# Altium schematic sheet 4 - Position2Go_Baseband.SchDoc
size A3; Release: RC00; PageSetup: Record=PageOptions|CenterHorizontal=True|CenterVertical=True|PrintScale=1.01|XCorrection=1.00|YCorrection=1.00|PrintKind=0|BorderSize=5000000|LeftOffset=0|BottomOffset=0|Orientation=2|PaperLength=1000|PaperWidth=1000|Scale=100|PaperSource=7|PrintQuality=-4|MediaType=1|DitherType=10|PaperKind=A3|PrintScaleMode=1; Doc_ConfidentialStatus: <Doc_ConfidentialStatus>; Doc_Preliminary: <Doc_Preliminary>
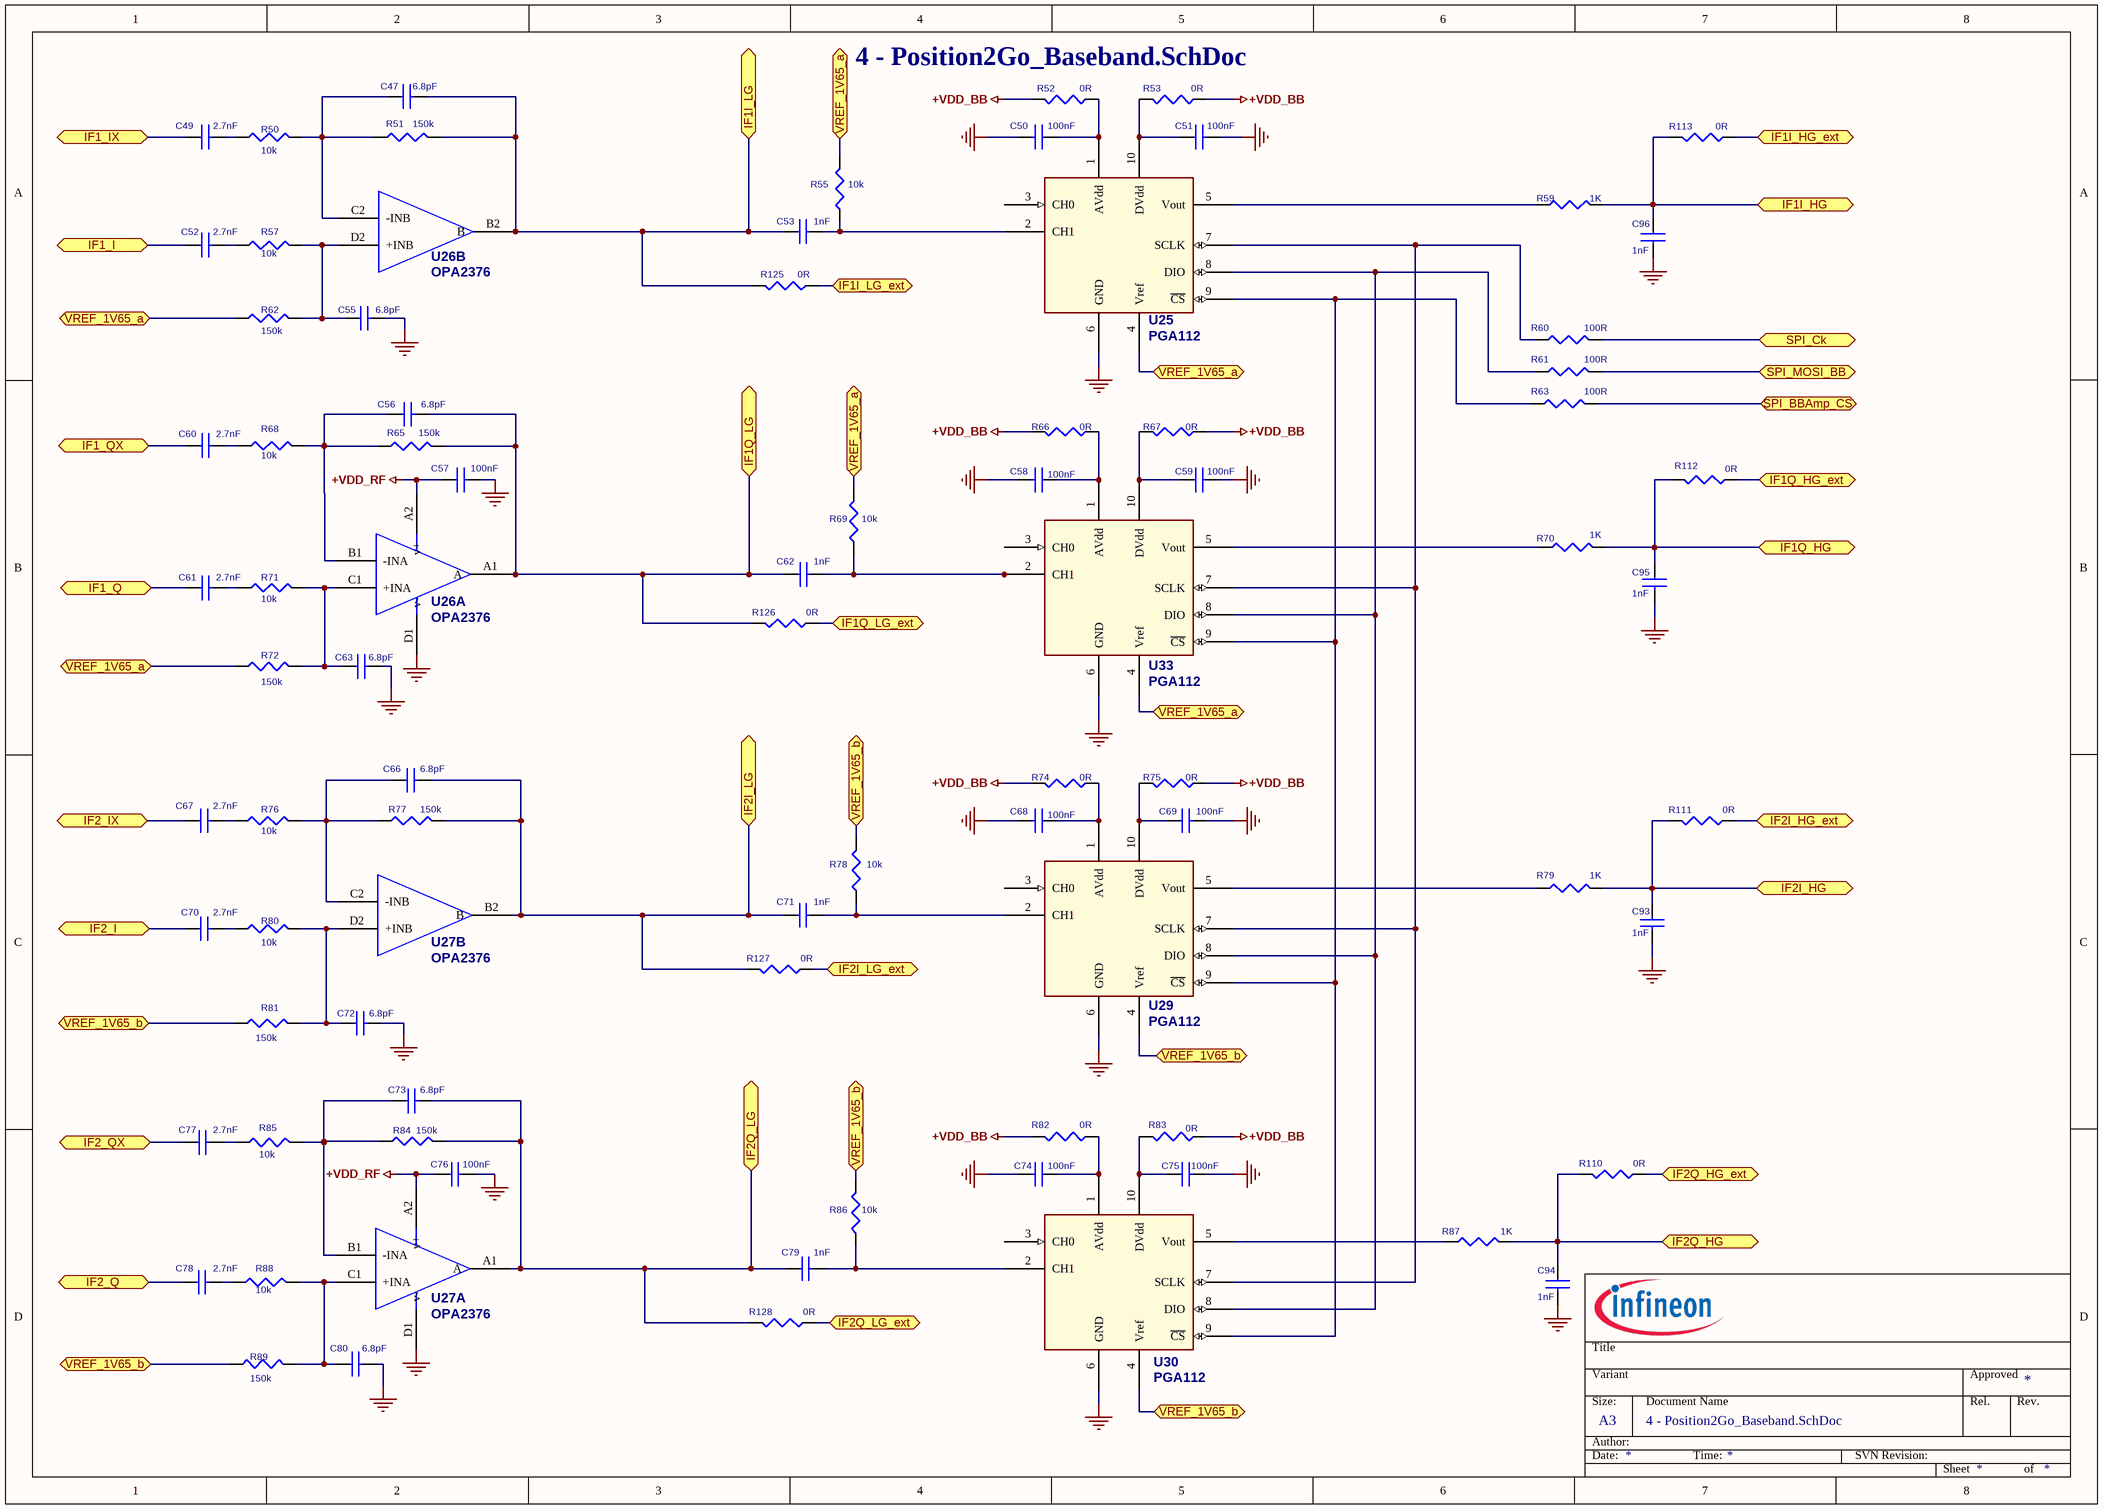
[diagram p0: 4 - Position2Go_Baseband.SchDoc]

## Parts
C47  6.8pF  [C_0201]
C49  2.7nF  [1206_40h]
C50  100nF  [C_0201]
C51  100nF  [C_0201]
C52  2.7nF  [1206_40h]
C53  1nF  [1206_40h]
C55  6.8pF  [C_0201]
C56  6.8pF  [C_0201]
C57  100nF  [C_0201]
C58  100nF  [C_0201]
C59  100nF  [C_0201]
C60  2.7nF  [1206_40h]
C61  2.7nF  [1206_40h]
C62  1nF  [1206_40h]
C63  6.8pF  [C_0201]
C66  6.8pF  [C_0201]
C67  2.7nF  [1206_40h]
C68  100nF  [C_0201]
C69  100nF  [C_0201]
C70  2.7nF  [1206_40h]
C71  1nF  [1206_40h]
C72  6.8pF  [C_0201]
C73  6.8pF  [C_0201]
C74  100nF  [C_0201]
C75  100nF  [C_0201]
C76  100nF  [C_0201]
C77  2.7nF  [1206_40h]
C78  2.7nF  [1206_40h]
C79  1nF  [1206_40h]
C80  6.8pF  [C_0201]
C93  1nF  [C_0201]
C94  1nF  [C_0201]
C95  1nF  [C_0201]
C96  1nF  [C_0201]
R50  10k  [R_0201]
R51  150k  [R_0201]
R52  0R  [R_0201]
R53  0R  [R_0201]
R55  10k  [R_0201]
R57  10k  [R_0201]
R59  1K  [R_0201]
R60  100R  [R_0201]
R61  100R  [R_0201]
R62  150k  [R_0201]
R63  100R  [R_0201]
R65  150k  [R_0201]
R66  0R  [R_0201]
R67  0R  [R_0201]
R68  10k  [R_0201]
R69  10k  [R_0201]
R70  1K  [R_0201]
R71  10k  [R_0201]
R72  150k  [R_0201]
R74  0R  [R_0201]
R75  0R  [R_0201]
R76  10k  [R_0201]
R77  150k  [R_0201]
R78  10k  [R_0201]
R79  1K  [R_0201]
R80  10k  [R_0201]
R81  150k  [R_0201]
R82  0R  [R_0201]
R83  0R  [R_0201]
R84  150k  [R_0201]
R85  10k  [R_0201]
R86  10k  [R_0201]
R87  1K  [R_0201]
R88  10k  [R_0201]
R89  150k  [R_0201]
R110  0R  [R_0201]
R111  0R  [R_0201]
R112  0R  [R_0201]
R113  0R  [R_0201]
R125  0R  [R_0201]
R126  0R  [R_0201]
R127  0R  [R_0201]
R128  0R  [R_0201]
U25  PGA112  [DGS0010A_M]
U26  OPA2376  [OPA2376_DSBGA]  (parts A,B of 2)
U27  OPA2376  [OPA2376_DSBGA]  (parts A,B of 2)
U29  PGA112  [DGS0010A_M]
U30  PGA112  [DGS0010A_M]
U33  PGA112  [DGS0010A_M]

## Ports
IF1_I (bidir), IF1_IX (bidir), IF1_Q (bidir), IF1_QX (bidir), IF1I_HG (bidir), IF1I_HG_ext (bidir), IF1I_LG (bidir), IF1I_LG_ext (bidir), IF1Q_HG (bidir), IF1Q_HG_ext (bidir), IF1Q_LG (bidir), IF1Q_LG_ext (bidir), IF2_I (bidir), IF2_IX (bidir), IF2_Q (bidir), IF2_QX (bidir), IF2I_HG (bidir), IF2I_HG_ext (bidir), IF2I_LG (bidir), IF2I_LG_ext (bidir), IF2Q_HG (bidir), IF2Q_HG_ext (bidir), IF2Q_LG (bidir), IF2Q_LG_ext (bidir), SPI_BBAmp_CS (bidir), SPI_Ck (bidir), SPI_MOSI_BB (bidir), VREF_1V65_a (bidir), VREF_1V65_b (bidir)

## Nets
+VDD_BB: R52.2 R53.2 R66.2 R67.2 R74.2 R75.2 R82.2 R83.2
+VDD_RF: C57.1 C76.1 U26.A2(v+) U27.A2(v+)
GND_POWER: C50.2 C51.2 C55.2 C57.2 C58.2 C59.2 C63.2 C68.2 C69.2 C72.2 C74.2 C75.2 C76.2 C80.2 C93.2 C94.2 C95.2 C96.2 U25.6(GND) U26.D1(v-) U27.D1(v-) U29.6(GND) U30.6(GND) U33.6(GND)
IF1_I: C52.1 ; port IF1_I
IF1_IX: C49.1 ; port IF1_IX
IF1_Q: C61.1 ; port IF1_Q
IF1_QX: C60.1 ; port IF1_QX
IF1I_HG: C96.1 R59.2 R113.2 ; port IF1I_HG
IF1I_HG_ext: R113.1 ; port IF1I_HG_ext
IF1I_LG: C47.2 C53.1 R51.2 R125.2 U26.B2(B) ; port IF1I_LG
IF1I_LG_ext: R125.1 ; port IF1I_LG_ext
IF1Q_HG: C95.1 R70.2 R112.2 ; port IF1Q_HG
IF1Q_HG_ext: R112.1 ; port IF1Q_HG_ext
IF1Q_LG: C56.2 C62.1 R65.2 R126.2 U26.A1(A) ; port IF1Q_LG
IF1Q_LG_ext: R126.1 ; port IF1Q_LG_ext
IF2_I: C70.1 ; port IF2_I
IF2_IX: C67.1 ; port IF2_IX
IF2_Q: C78.1 ; port IF2_Q
IF2_QX: C77.1 ; port IF2_QX
IF2I_HG: C93.1 R79.2 R111.2 ; port IF2I_HG
IF2I_HG_ext: R111.1 ; port IF2I_HG_ext
IF2I_LG: C66.2 C71.1 R77.2 R127.2 U27.B2(B) ; port IF2I_LG
IF2I_LG_ext: R127.1 ; port IF2I_LG_ext
IF2Q_HG: C94.1 R87.2 R110.2 ; port IF2Q_HG
IF2Q_HG_ext: R110.1 ; port IF2Q_HG_ext
IF2Q_LG: C73.2 C79.1 R84.2 R128.2 U27.A1(A) ; port IF2Q_LG
IF2Q_LG_ext: R128.1 ; port IF2Q_LG_ext
SPI_BBAmp_CS: R63.2 ; port SPI_BBAmp_CS
SPI_Ck: R60.2 ; port SPI_Ck
SPI_MOSI_BB: R61.2 ; port SPI_MOSI_BB
VREF_1V65_a: R55.2 R62.2 R69.2 R72.2 U25.4(Vref) U33.4(Vref) ; port VREF_1V65_a
VREF_1V65_b: R78.2 R81.2 R86.2 R89.2 U29.4(Vref) U30.4(Vref) ; port VREF_1V65_b
NetC47_1: C47.1 R50.2 R51.1 U26.C2(-INB)
NetC49_2: C49.2 R50.1
NetC50_1: C50.1 R52.1 U25.1(AVdd)
NetC51_1: C51.1 R53.1 U25.10(DVdd)
NetC52_2: C52.2 R57.1
NetC53_2: C53.2 R55.1 U25.2(CH1)
NetC55_1: C55.1 R57.2 R62.1 U26.D2(+INB)
NetC56_1: C56.1 R65.1 R68.2 U26.B1(-INA)
NetC58_1: C58.1 R66.1 U33.1(AVdd)
NetC59_1: C59.1 R67.1 U33.10(DVdd)
NetC60_2: C60.2 R68.1
NetC61_2: C61.2 R71.1
NetC62_2: C62.2 R69.1 U33.2(CH1)
NetC63_1: C63.1 R71.2 R72.1 U26.C1(+INA)
NetC66_1: C66.1 R76.2 R77.1 U27.C2(-INB)
NetC67_2: C67.2 R76.1
NetC68_1: C68.1 R74.1 U29.1(AVdd)
NetC69_1: C69.1 R75.1 U29.10(DVdd)
NetC70_2: C70.2 R80.1
NetC71_2: C71.2 R78.1 U29.2(CH1)
NetC72_1: C72.1 R80.2 R81.1 U27.D2(+INB)
NetC73_1: C73.1 R84.1 R85.2 U27.B1(-INA)
NetC74_1: C74.1 R82.1 U30.1(AVdd)
NetC75_1: C75.1 R83.1 U30.10(DVdd)
NetC77_2: C77.2 R85.1
NetC78_2: C78.2 R88.1
NetC79_2: C79.2 R86.1 U30.2(CH1)
NetC80_1: C80.1 R88.2 R89.1 U27.C1(+INA)
NetR59_1: R59.1 U25.5(Vout)
NetR60_1: R60.1 U25.7(SCLK) U29.7(SCLK) U30.7(SCLK) U33.7(SCLK)
NetR61_1: R61.1 U25.8(DIO) U29.8(DIO) U30.8(DIO) U33.8(DIO)
NetR63_1: R63.1 U25.9(~{CS}) U29.9(~{CS}) U30.9(~{CS}) U33.9(~{CS})
NetR70_1: R70.1 U33.5(Vout)
NetR79_1: R79.1 U29.5(Vout)
NetR87_1: R87.1 U30.5(Vout)

Not connected (* = marked no-connect by the designer): U25 3(CH0); U29 3(CH0); U30 3(CH0); U33 3(CH0)

## Notes on the sheet
- Title
- Variant
- Approved
- Date:
- Author:
- Size:
- A3
- Document Name
- Time:
- SVN Revision:
- Rel.
- Rev.
- Sheet
- of

## Library data of the parts
C47 C55 C56 C63 C66 C72 C73 C80 = 15pF_Dup1: Tolerance: 0,5%; Voltage: 25V; Part Type: capacitor\ceramic
C49 C52 C53 C60-C62 C67 C70 C71 C77-C79 = 220uF: Voltage: 50V; Tolerance: 5%; Part Type: capacitor\ceramic
C50 C51 C57-C59 C68 C69 C74-C76 = 100nF_Dup1: code_DK: 490-10430-1-ND; Voltage: 50V; Tolerance: 5%; Part Type: capacitor\ceramic
C93-C96 = 1nF: Tolerance: 10%; Voltage: 25V; code_DK: 445-4695-1-ND; Part Type: capacitor\ceramic
R50 R55 R57 R68 R69 R71 R76 R78 R80 R85 R86 R88 = 10K_Dup1: code_DK_reel: 311-1KMDKR-ND; code_DK: 311-10.0KMCT-ND; tolerance: 1%; Power: 0.063W; size: 0201
R51 R62 R65 R72 R77 R81 R84 R89 = 100K: Power: 0.063W; tolerance: 1%; size: 0201
R52 R53 R66 R67 R74 R75 R82 R83 R110-R113 R125-R128 = 0_Dup2: code_DK: 311-0.0NCT-ND; tolerance: 1%; Power: 0.063W; size: 0201
R59 R70 R79 R87 = 10: code_DK: 311-1KMCT-ND; tolerance: 1%; Power: 0.063W; size: 0201
R60 R61 R63 = 100: code_DK: 311-100MCT-ND; tolerance: 1%; Power: 0.063W; size: 0201
U25 U29 U30 U33 = PGA112: code_DK: 296-23315-1-ND
U26 U27 = OPA2376_DSBGA_Dup1: code_DK: 296-39119-1-ND